# Altium schematic sheet X7A15T-Power.SchDoc: X7A15T-Power
size A4 portrait; Organization: Semi-ATE; SheetNumber: 5; SheetTotal: 7; Date: JUN 2020; ApprovedBy: Hören; CheckedBy: Mörz; Author: Hören; DrawnBy: Rudziński; Engineer: Hören
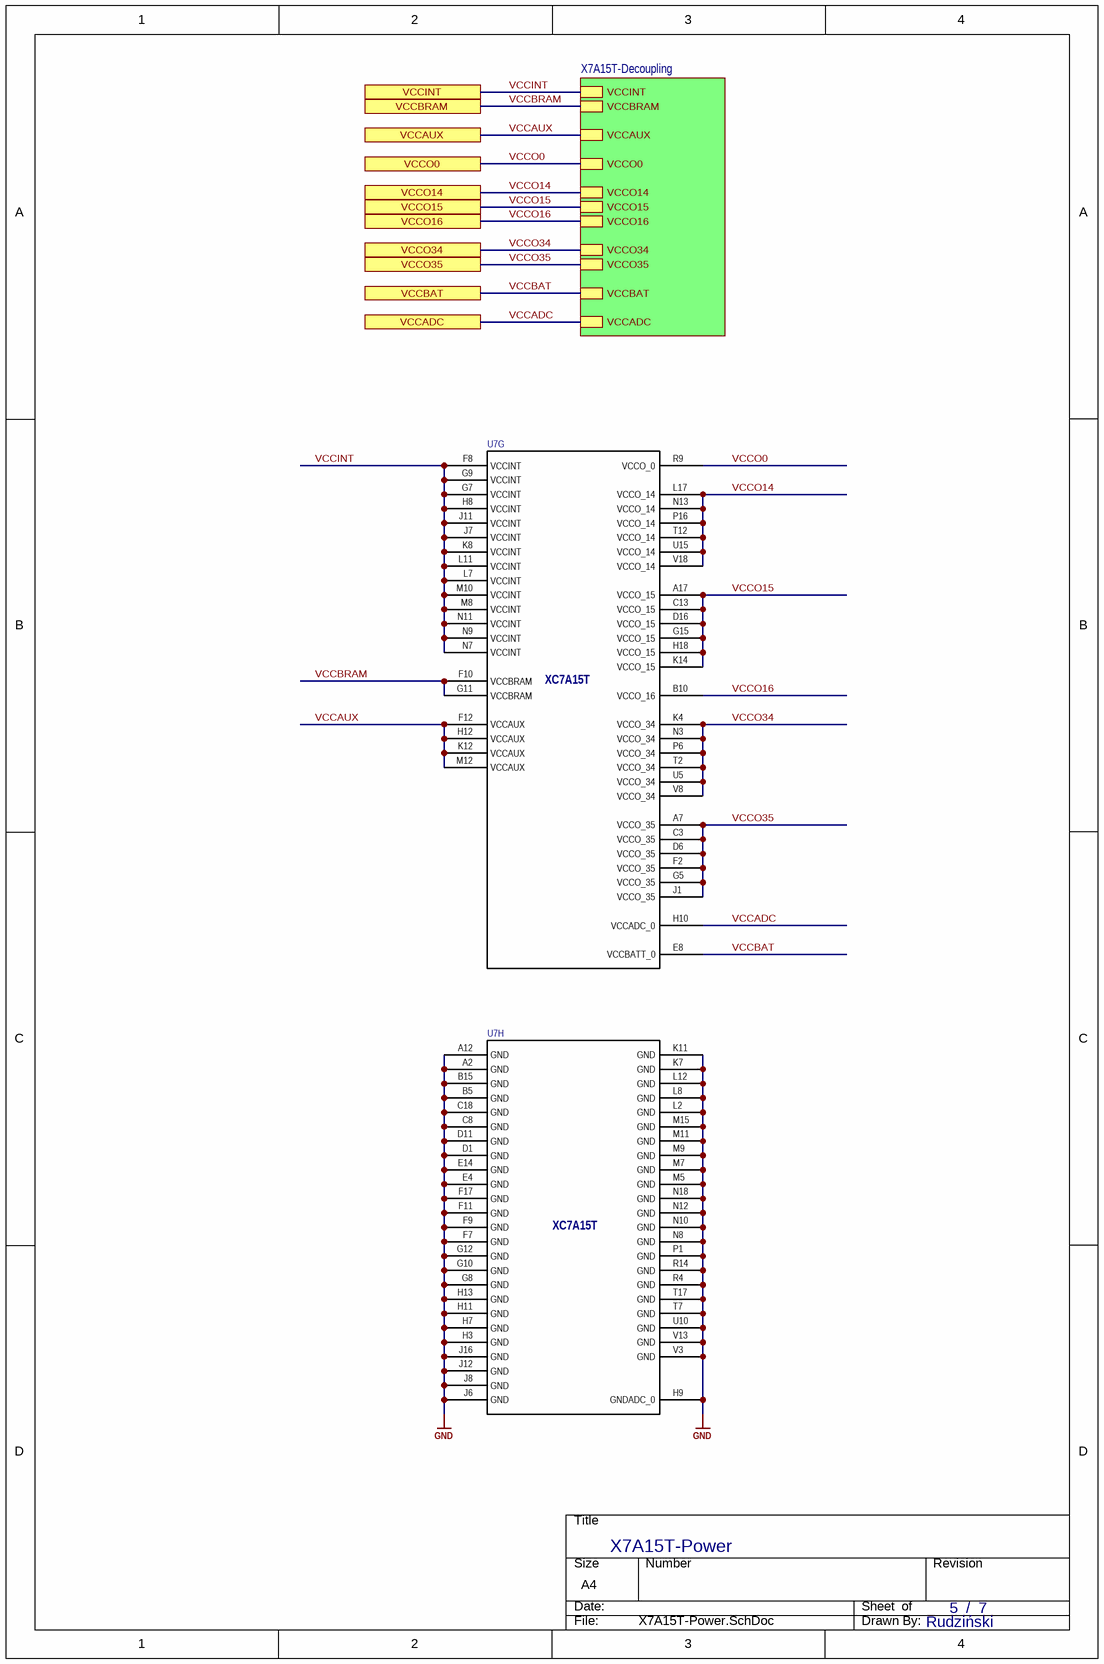
[diagram p0: X7A15T-Power.SchDoc]

## Parts
U7  NicName: XC7A15T  [XC7A15T-1CSG324C]  (hidden comment: U)  (parts G,H of 8)

## Sub-sheets
X7A15T-Decoupling = X7A15T-Decoupling.SchDoc: VCCBRAM, VCCAUX, VCCINT, VCCO34, VCCBAT, VCCO14, VCCO15, VCCO0, VCCADC, VCCO16, VCCO35

## Ports
VCCADC, VCCAUX, VCCBAT, VCCBRAM, VCCINT, VCCO0, VCCO14, VCCO15, VCCO16, VCCO34, VCCO35

## Nets
GND: U7.A2(GND) U7.A12(GND) U7.B5(GND) U7.B15(GND) U7.C8(GND) U7.C18(GND) U7.D1(GND) U7.D11(GND) U7.E4(GND) U7.E14(GND) U7.F7(GND) U7.F9(GND) U7.F11(GND) U7.F17(GND) U7.G8(GND) U7.G10(GND) U7.G12(GND) U7.H3(GND) U7.H7(GND) U7.H9(GNDADC_0) U7.H11(GND) U7.H13(GND) U7.J6(GND) U7.J8(GND) U7.J12(GND) U7.J16(GND) U7.K7(GND) U7.K11(GND) U7.L2(GND) U7.L8(GND) U7.L12(GND) U7.M5(GND) U7.M7(GND) U7.M9(GND) U7.M11(GND) U7.M15(GND) U7.N8(GND) U7.N10(GND) U7.N12(GND) U7.N18(GND) U7.P1(GND) U7.R4(GND) U7.R14(GND) U7.T7(GND) U7.T17(GND) U7.U10(GND) U7.V3(GND) U7.V13(GND)
VCCADC: U7.H10(VCCADC_0) ; port VCCADC, sheet X7A15T-Decoupling/VCCADC
VCCAUX: U7.F12(VCCAUX) U7.H12(VCCAUX) U7.K12(VCCAUX) U7.M12(VCCAUX) ; port VCCAUX, sheet X7A15T-Decoupling/VCCAUX
VCCBAT: U7.E8(VCCBATT_0) ; port VCCBAT, sheet X7A15T-Decoupling/VCCBAT
VCCBRAM: U7.F10(VCCBRAM) U7.G11(VCCBRAM) ; port VCCBRAM, sheet X7A15T-Decoupling/VCCBRAM
VCCINT: U7.F8(VCCINT) U7.G7(VCCINT) U7.G9(VCCINT) U7.H8(VCCINT) U7.J7(VCCINT) U7.J11(VCCINT) U7.K8(VCCINT) U7.L7(VCCINT) U7.L11(VCCINT) U7.M8(VCCINT) U7.M10(VCCINT) U7.N7(VCCINT) U7.N9(VCCINT) U7.N11(VCCINT) ; port VCCINT, sheet X7A15T-Decoupling/VCCINT
VCCO0: U7.R9(VCCO_0) ; port VCCO0, sheet X7A15T-Decoupling/VCCO0
VCCO14: U7.L17(VCCO_14) U7.N13(VCCO_14) U7.P16(VCCO_14) U7.T12(VCCO_14) U7.U15(VCCO_14) U7.V18(VCCO_14) ; port VCCO14, sheet X7A15T-Decoupling/VCCO14
VCCO15: U7.A17(VCCO_15) U7.C13(VCCO_15) U7.D16(VCCO_15) U7.G15(VCCO_15) U7.H18(VCCO_15) U7.K14(VCCO_15) ; port VCCO15, sheet X7A15T-Decoupling/VCCO15
VCCO16: U7.B10(VCCO_16) ; port VCCO16, sheet X7A15T-Decoupling/VCCO16
VCCO34: U7.K4(VCCO_34) U7.N3(VCCO_34) U7.P6(VCCO_34) U7.T2(VCCO_34) U7.U5(VCCO_34) U7.V8(VCCO_34) ; port VCCO34, sheet X7A15T-Decoupling/VCCO34
VCCO35: U7.A7(VCCO_35) U7.C3(VCCO_35) U7.D6(VCCO_35) U7.F2(VCCO_35) U7.G5(VCCO_35) U7.J1(VCCO_35) ; port VCCO35, sheet X7A15T-Decoupling/VCCO35

## Notes on the sheet
- /
- designed by
- reviewed by
- last drawn by
- Project:
- Schematic:
- last printed
- DIN-A4 P
- sheets
- of
- File:

## Library data of the parts
U7 = XC7A15T-CS324: XC7A15T-1CSG324C; MFR: XILINX; POPULATED: yes; 03. Unit Price: 20.65; MFR-PN: XC7A15T-CS324; 04. Manufacturer: XILINX; 07. Manufacturer  Part Number: XC7A15T-1CSG324C; 01. Distributor: Avnet; 02. Distributor Part Number: XC7A15T-1CSG324C; 09. Operating Temperature: 0°C ~ 85°C (TJ); 11. RoHS: YES; ComponentLink4Description: Info; ComponentLink4URL: https://www.digikey.de/products/en?keywords=XC7A15T-1CSG324C; ComponentLink5Description: DataSheet; ComponentLink5URL: https://www.xilinx.com/support/documentation/data_sheets/ds181_Artix_7_Data_Sheet.pdf; ComponentLink6Description: NXP; ComponentLink6URL: https://www.nxp.com/part/MK20DN512VMD10